# Altium project DA1_prj.PrjPcb (part 2 of 2)

## Sheet DAC.SchDoc: DAC
size 420 x 297 mm; Date: March 14; CheckedBy: ThS. Bùi Quốc Bảo; DrawnBy: Nguyễn Gia Huy; Revision: V1.0; SheetNumber: 10; SheetTotal: 11; MasterProject: STM32-PLC; Sub-system: DA1_prj.PrjPcb
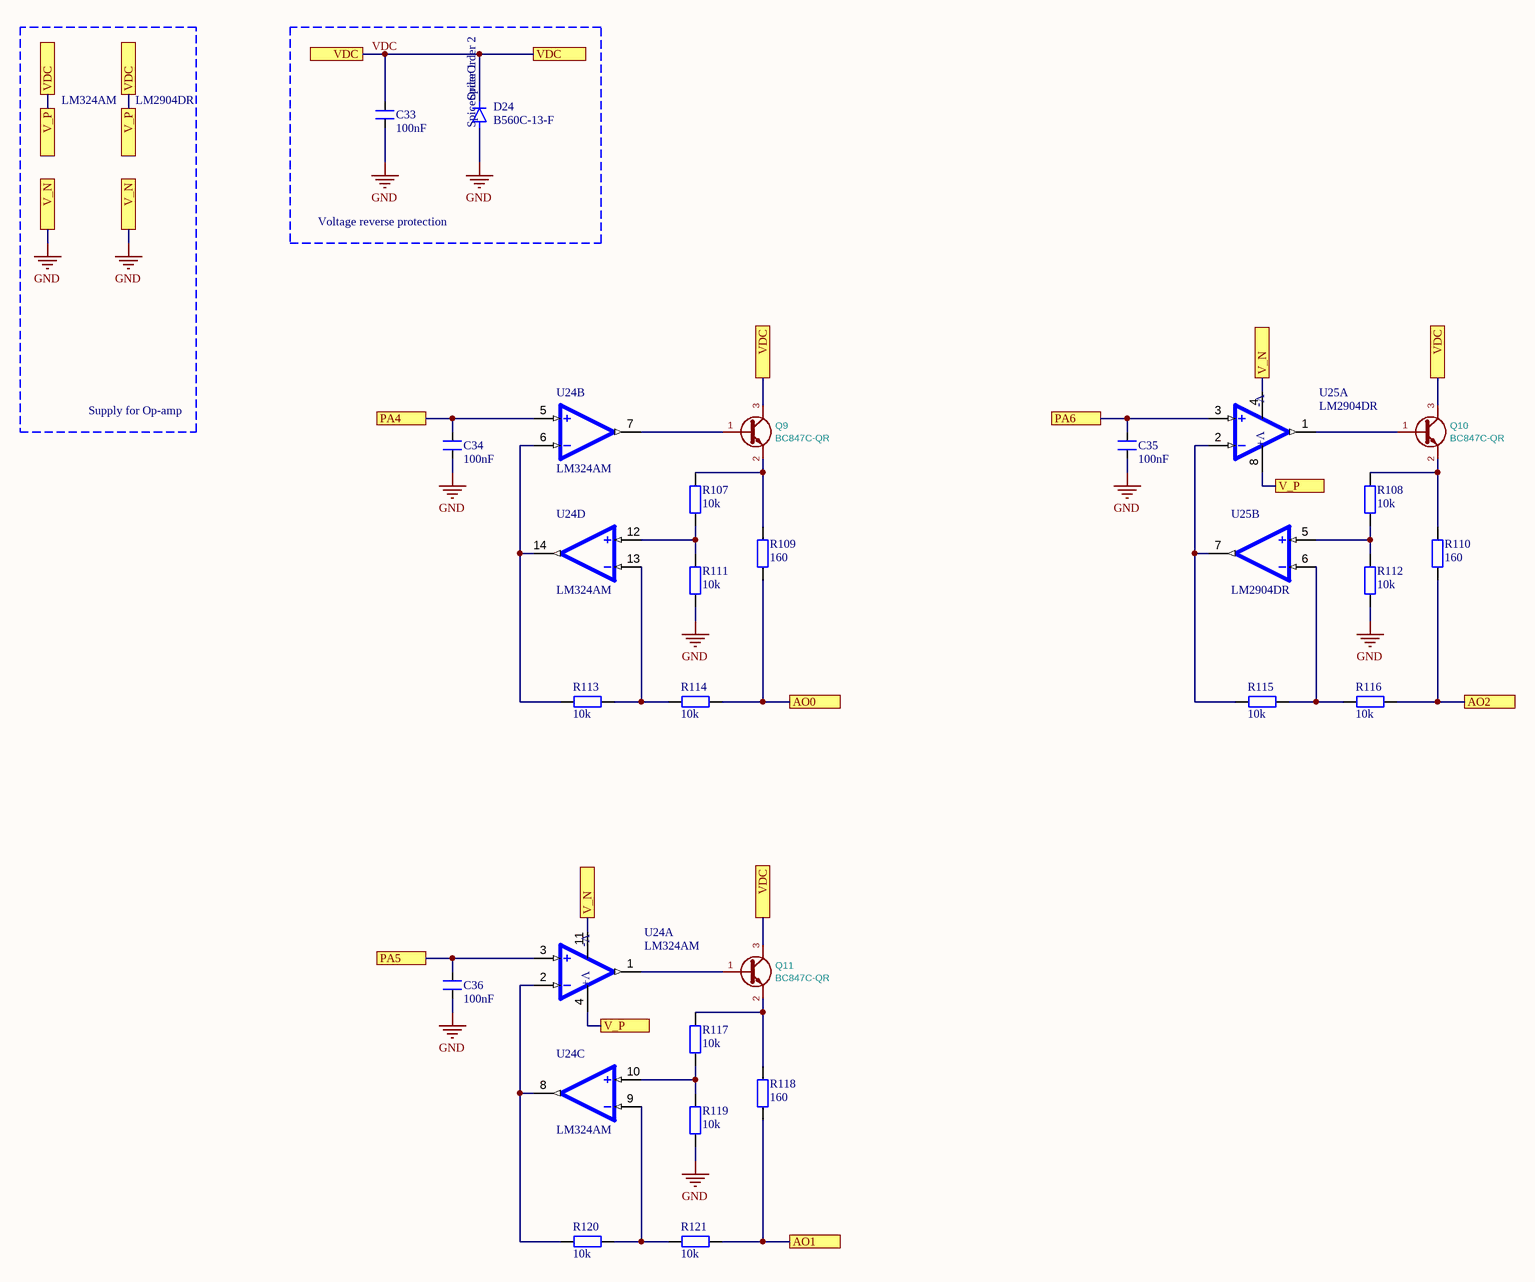
[diagram p9: DAC.SchDoc]

### Parts
C33  100nF  [FP-C0603C-CF-IPC_A]
C34  100nF  [FP-C0603C-CF-IPC_A]
C35  100nF  [FP-C0603C-CF-IPC_A]
C36  100nF  [FP-C0603C-CF-IPC_A]
D24  B560C-13-F  [SMC]
Q9  BC847C-QR  [SOT95P240X111-3N]
Q10  BC847C-QR  [SOT95P240X111-3N]
Q11  BC847C-QR  [SOT95P240X111-3N]
R107  10k  [tro smd 0603]
R108  10k  [tro smd 0603]
R109  160  [tro smd 0603]
R110  160  [tro smd 0603]
R111  10k  [tro smd 0603]
R112  10k  [tro smd 0603]
R113  10k  [tro smd 0603]
R114  10k  [tro smd 0603]
R115  10k  [tro smd 0603]
R116  10k  [tro smd 0603]
R117  10k  [tro smd 0603]
R118  160  [tro smd 0603]
R119  10k  [tro smd 0603]
R120  10k  [tro smd 0603]
R121  10k  [tro smd 0603]
U24  LM324AM  [SOIC127P600X175-14N]  (parts A,B,C,D of 4)
U25  LM2904DR  [SOIC127P599X175-8N]  (parts A,B of 2)

### Blocks framed on the sheet
Voltage reverse protection: C33 D24

### Ports
AO0 (see STM32_PLC[4C]), AO1 (see STM32_PLC[4C]), AO2 (see STM32_PLC[4C]), PA4 (see STM32_PLC[1B], STM32_PLC[4C]), PA5 (see STM32_PLC[1B], STM32_PLC[4C]), PA6 (see STM32_PLC[1B], STM32_PLC[4C]), V_N (see DAC[1A], DAC[2C]), V_N (see DAC[1A], DAC[2C], DAC[4B]), V_N (see DAC[1A], DAC[4B]), V_P (see DAC[1A], DAC[2C]), V_P (see DAC[1A], DAC[2C], DAC[4B]), V_P (see DAC[1A], DAC[4B]), VDC (see DAC[1A], DAC[2A], DAC[3B], DAC[3C], DAC[5B], STM32_PLC[4C]), VDC (see DAC[1A], DAC[2A], DAC[3B], DAC[3C], STM32_PLC[4C]), VDC (see DAC[1A], DAC[2A], DAC[3B], DAC[5B], STM32_PLC[4C]), VDC (see DAC[1A], DAC[2A], DAC[3C], DAC[5B], STM32_PLC[4C])

### Nets
GND: C33.2 C34.2 C35.2 C36.2 D24.A R111.1 R112.1 R119.1 U24.11(GND) U25.4(V-) ; port V_N
VDC: C33.1 D24.C Q9.3(C) Q10.3(C) Q11.3(C) U24.4(V+) U25.8(V+) ; port VDC, port V_P
NetC34_1: C34.1 U24.5(IN2+) ; port PA4
NetC35_1: C35.1 U25.3(IN1+) ; port PA6
NetC36_1: C36.1 U24.3(IN1+) ; port PA5
NetP4_1: R109.1 R114.1 ; port AO0
NetP4_2: R118.1 R121.1 ; port AO1
NetP4_3: R110.1 R116.1 ; port AO2
NetQ9_1: Q9.1(B) U24.7(OUT2)
NetQ9_2: Q9.2(E) R107.2 R109.2
NetQ10_1: Q10.1(B) U25.1(OUT1)
NetQ10_2: Q10.2(E) R108.2 R110.2
NetQ11_1: Q11.1(B) U24.1(OUT1)
NetQ11_2: Q11.2(E) R117.2 R118.2
NetR107_1: R107.1 R111.2 U24.12(IN4+)
NetR108_1: R108.1 R112.2 U25.5(IN2+)
NetR113_1: R113.1 R114.2 U24.13(IN4-)
NetR113_2: R113.2 U24.6(IN2-) U24.14(OUT4)
NetR115_1: R115.1 R116.2 U25.6(IN2-)
NetR115_2: R115.2 U25.2(IN1-) U25.7(OUT2)
NetR117_1: R117.1 R119.2 U24.10(IN3+)
NetR120_1: R120.1 R121.2 U24.9(IN3-)
NetR120_2: R120.2 U24.2(IN1-) U24.8(OUT3)

### Notes on the sheet
- LM324AM
- LM2904DR
- Supply for Op-amp
- Sub-system:
- Project:
- Design by:
- Sheet title:
- Sheet
- of
- Checked by:
- Approved by:
- Doc No:
- Revision:
- Size:
- Dates:
- A3
- (in symbol B560C-13-F) SpiceOrder 2; SpiceOrder 1
- (in symbol LM324AM/NOPB, part A) V-

### Library data of the parts
C33-C36 = CN-SEMI-DIP: Capacitor (Semiconductor SIM Model); Value: 104; LatestRevisionDate: 17-Jul-2002; LatestRevisionNote: Re-released for DXP Platform.; PackageReference: C1206; Publisher: Altium Limited
D24 = B560C-13-F: Diode Schottky 60 V 5A Surface Mount SMC; MF: Diodes Inc.; SnapEDA_Link: https://www.snapeda.com/parts/B560C-13-F/Diodes+Inc./view-part/?ref=snap; Package: SMC-2 Diodes; Value: *; MP: B560C-13-F; Check_prices: https://www.snapeda.com/parts/B560C-13-F/Diodes+Inc./view-part/?ref=eda
Q9-Q11 = BC847: LCSC: C2145; Value: BC847C-QR; Footprint: Package_TO_SOT_SMD:SOT-23
R107-R121 = Tro 0603 1% 10k: RES; Chung_Loai: Dán; Don_Vi: Con; So_Chan: 2; Ten_Linh_Kien: Trở 0603 1% 10k; Ma_Hang: MH006333; Kieu_Chan: *
U24 = LM324AM/NOPB: Low power general-purpose quad operational amplifier 14-SOIC 0 to 70; MF: Texas Instruments; SnapEDA_Link: https://www.snapeda.com/parts/LM324AM/Texas+Instruments/view-part/?ref=snap; Package: SOIC-14 Texas Instruments; Value: *; MP: LM324AM; Check_prices: https://www.snapeda.com/parts/LM324AM/Texas+Instruments/view-part/?ref=eda
U25 = LM2904DR: Dual, 26-V, 700-kHz operational amplifier; MF: Texas Instruments; SnapEDA_Link: https://www.snapeda.com/parts/LM2904DR/Texas+Instruments/view-part/?ref=snap; Package: SOIC-8 Texas Instruments; Value: *; MP: LM2904DR; Check_prices: https://www.snapeda.com/parts/LM2904DR/Texas+Instruments/view-part/?ref=eda

## Sheet LED.SchDoc: LED
size 420 x 297 mm; Date: March 14; CheckedBy: ThS. Bùi Quốc Bảo; DrawnBy: Nguyễn Gia Huy; Revision: V1.0; SheetNumber: 11; SheetTotal: 11; MasterProject: STM32-PLC; Sub-system: DA1_prj.PrjPcb
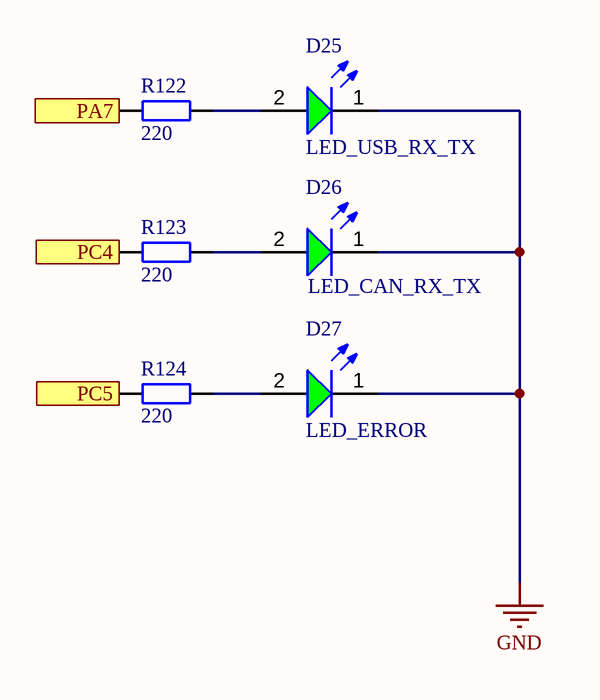
[diagram p10: LED.SchDoc]

### Parts
D25  LED_USB_RX_TX  [WL-SMCW_0603_150060xx75000]
D26  LED_CAN_RX_TX  [WL-SMCW_0603_150060xx75000]
D27  LED_ERROR  [WL-SMCW_0603_150060xx75000]
R122  220  [tro smd 0603]
R123  220  [tro smd 0603]
R124  220  [tro smd 0603]

### Ports
PA7 (see STM32_PLC[1B], STM32_PLC[5C]), PC4 (see STM32_PLC[2B], STM32_PLC[5C]), PC5 (see STM32_PLC[2B], STM32_PLC[5C])

### Nets
GND: D25.1(K) D26.1(K) D27.1(K)
NetD25_2: D25.2(A) R122.2
NetD26_2: D26.2(A) R123.2
NetD27_2: D27.2(A) R124.2
NetR122_1: R122.1 ; port PA7
NetR123_1: R123.1 ; port PC4
NetR124_1: R124.1 ; port PC5

### Notes on the sheet
- Sub-system:
- Project:
- Design by:
- Sheet title:
- Sheet
- of
- Checked by:
- Approved by:
- Doc No:
- Revision:
- Size:
- Dates:
- A3

### Library data of the parts
D25-D27 = CMP-1426-00002-4: 430mcd Colorless transparence 520nm Emerald 140° LED0603 Light Emitting Diodes (LED) ROHS; Peak Wavelength: 515nm; Forward Current: 100mA; Reverse Voltage: 5V; Output Current: 10µA; Power Dissipation: 105mW; Lens Style: Clear, Rectangular; Dominant Wavelength: 525nm; Color: Green; Test Current: 20mA; Max Junction Temperature (Tj): 95°C; Forward Voltage: 3.2V; Width: 800µm; Max Operating Temperature: 85°C; Case Code (Metric): 1608; Luminous Intensity: 430mcd; Lead Free: Lead Free; Case/Package: 0603; Case Code (Imperial): 0603; Mount: Surface Mount; Max Reverse Voltage (DC): 5V; Packaging: Tape and Reel; RoHS: Compliant; Viewing Angle: 140°; REACH SVHC: Unknown; Min Operating Temperature: -40°C; Height: 700µm; Wavelength: 525nm; Length: 1.6mm
R122-R124 = Tro 0603 1% 10k: as R107 on sheet DAC; Kieu_Chan: *

## Nets that join several sheets
+3,3V: STM32_PLC (32 pins), INPUT (10 pins), PULSE (10 pins), CAN (C30.2 U3.3)
+5V: STM32_PLC (C11.2 U1.1 U1.3 X1.1), INPUT (10 pins), PULSE (10 pins)
GND: STM32_PLC (44 pins), INPUT (30 pins), DIGTITAL (32 pins), DSDADC (20 pins), PULSE (20 pins), CAN (8 pins), SDADC (24 pins), DAC (10 pins), LED (D25.1 D26.1 D27.1)
NetC27_2: STM32_PLC (P1.6), CAN (C27.2 D1.1 R3.2 U3.7)
NetC29_1: STM32_PLC (U2.81), CAN (C29.1 U3.4)
NetC31_2: STM32_PLC (U2.82), CAN (C31.2 U3.1)
NetC32_2: STM32_PLC (P1.5), CAN (C32.2 D1.2 R6.1 U3.6)
NetC34_1: STM32_PLC (U2.29), DAC (C34.1 U24.5)
NetC35_1: STM32_PLC (U2.31), DAC (C35.1 U25.3)
NetC36_1: STM32_PLC (U2.30), DAC (C36.1 U24.3)
NetD2_3: STM32_PLC (U2.62), DSDADC (D2.3 R43.2)
NetD3_3: STM32_PLC (U2.58), DSDADC (D3.3 R44.2)
NetD4_3: STM32_PLC (U2.53), DSDADC (D4.3 R45.2)
NetD5_3: STM32_PLC (U2.61), DSDADC (D5.3 R49.2)
NetD6_3: STM32_PLC (U2.57), DSDADC (D6.3 R50.2)
NetD7_3: STM32_PLC (U2.54), DSDADC (D7.3 R51.2)
NetD8_3: STM32_PLC (U2.60), DSDADC (D8.3 R55.2)
NetD9_3: STM32_PLC (U2.56), DSDADC (D9.3 R56.2)
NetD10_3: STM32_PLC (U2.59), DSDADC (D10.3 R59.2)
NetD11_3: STM32_PLC (U2.55), DSDADC (D11.3 R60.2)
NetD12_3: STM32_PLC (U2.46), SDADC (D12.3 R83.2)
NetD13_3: STM32_PLC (U2.42), SDADC (D13.3 R84.2)
NetD14_3: STM32_PLC (U2.38), SDADC (D14.3 R85.2)
NetD15_3: STM32_PLC (U2.45), SDADC (D15.3 R89.2)
NetD16_3: STM32_PLC (U2.41), SDADC (D16.3 R90.2)
NetD17_3: STM32_PLC (U2.37), SDADC (D17.3 R91.2)
NetD18_3: STM32_PLC (U2.44), SDADC (D18.3 R95.2)
NetD19_3: STM32_PLC (U2.40), SDADC (D19.3 R96.2)
NetD20_3: STM32_PLC (U2.36), SDADC (D20.3 R97.2)
NetD21_3: STM32_PLC (U2.43), SDADC (D21.3 R101.2)
NetD22_3: STM32_PLC (U2.39), SDADC (D22.3 R102.2)
NetD23_3: STM32_PLC (U2.35), SDADC (D23.3 R103.2)
NetF1_1: STM32_PLC (P6.1), DIGTITAL (F1.1)
NetF2_1: STM32_PLC (P9.1), DIGTITAL (F2.1)
NetF3_1: STM32_PLC (P6.6), DIGTITAL (F3.1)
NetF4_1: STM32_PLC (P6.4), DIGTITAL (F4.1)
NetF5_1: STM32_PLC (P6.2), DIGTITAL (F5.1)
NetF6_1: STM32_PLC (P9.2), DIGTITAL (F6.1)
NetF7_1: STM32_PLC (P6.5), DIGTITAL (F7.1)
NetF8_1: STM32_PLC (P6.3), DIGTITAL (F8.1)
NetF9_2: STM32_PLC (P5.4), DSDADC (F9.2)
NetF10_2: STM32_PLC (P8.6), DSDADC (F10.2)
NetF11_2: STM32_PLC (P8.1), DSDADC (F11.2)
NetF12_2: STM32_PLC (P5.3), DSDADC (F12.2)
NetF13_2: STM32_PLC (P8.5), DSDADC (F13.2)
NetF14_2: STM32_PLC (P8.2), DSDADC (F14.2)
NetF15_2: STM32_PLC (P5.2), DSDADC (F15.2)
NetF16_2: STM32_PLC (P8.4), DSDADC (F16.2)
NetF17_2: STM32_PLC (P5.1), DSDADC (F17.2)
NetF18_2: STM32_PLC (P8.3), DSDADC (F18.2)
NetF19_2: STM32_PLC (P2.6), SDADC (F19.2)
NetF20_2: STM32_PLC (P2.2), SDADC (F20.2)
NetF21_2: STM32_PLC (P3.4), SDADC (F21.2)
NetF22_2: STM32_PLC (P2.5), SDADC (F22.2)
NetF23_2: STM32_PLC (P2.1), SDADC (F23.2)
NetF24_2: STM32_PLC (P3.3), SDADC (F24.2)
NetF25_2: STM32_PLC (P2.4), SDADC (F25.2)
NetF26_2: STM32_PLC (P3.6), SDADC (F26.2)
NetF27_2: STM32_PLC (P3.2), SDADC (F27.2)
NetF28_2: STM32_PLC (P2.3), SDADC (F28.2)
NetF29_2: STM32_PLC (P3.5), SDADC (F29.2)
NetF30_2: STM32_PLC (P3.1), SDADC (F30.2)
NetP1_1: STM32_PLC (P1.1), PULSE (R79.1 U22.1)
NetP1_2: STM32_PLC (P1.2), PULSE (R75.1 U20.1)
NetP1_3: STM32_PLC (P1.3), PULSE (R69.1 U17.1)
NetP1_4: STM32_PLC (P1.4), PULSE (R63.1 U14.1)
NetP4_1: STM32_PLC (P4.1), DAC (R109.1 R114.1)
NetP4_2: STM32_PLC (P4.2), DAC (R118.1 R121.1)
NetP4_3: STM32_PLC (P4.3), DAC (R110.1 R116.1)
NetP7_1: STM32_PLC (P7.1), PULSE (R73.1 U19.1)
NetP7_2: STM32_PLC (P7.2), PULSE (R67.1 U16.1)
NetP7_3: STM32_PLC (P7.3), PULSE (R81.1 U23.1)
NetP7_4: STM32_PLC (P7.4), PULSE (R77.1 U21.1)
NetP7_5: STM32_PLC (P7.5), PULSE (R71.1 U18.1)
NetP7_6: STM32_PLC (P7.6), PULSE (R65.1 U15.1)
NetP10_1: STM32_PLC (P10.1), INPUT (R25.1 SW2.11 U13.1)
NetP10_2: STM32_PLC (P10.2), INPUT (R21.1 SW2.12 U11.1)
NetP10_3: STM32_PLC (P10.3), INPUT (R17.1 SW2.13 U9.1)
NetP10_4: STM32_PLC (P10.4), INPUT (R13.1 SW2.14 U7.1)
NetP11_1: STM32_PLC (P11.1), INPUT (R9.1 SW2.15 U5.1)
NetP11_2: STM32_PLC (P11.2), INPUT (R23.1 SW2.16 U12.1)
NetP11_3: STM32_PLC (P11.3), INPUT (R19.1 SW2.17 U10.1)
NetP11_4: STM32_PLC (P11.4), INPUT (R15.1 SW2.18 U8.1)
NetP11_5: STM32_PLC (P11.5), INPUT (R11.1 SW2.19 U6.1)
NetP11_6: STM32_PLC (P11.6), INPUT (R7.1 SW2.20 U4.1)
NetR8_1: STM32_PLC (U2.11), INPUT (R8.1 U4.4)
NetR10_1: STM32_PLC (U2.5), INPUT (R10.1 U5.4)
NetR12_1: STM32_PLC (U2.10), INPUT (R12.1 U6.4)
NetR14_1: STM32_PLC (U2.4), INPUT (R14.1 U7.4)
NetR16_1: STM32_PLC (U2.90), INPUT (R16.1 U8.4)
NetR18_1: STM32_PLC (U2.3), INPUT (R18.1 U9.4)
NetR20_1: STM32_PLC (U2.91), INPUT (R20.1 U10.4)
NetR22_1: STM32_PLC (U2.2), INPUT (R22.1 U11.4)
NetR24_1: STM32_PLC (U2.7), INPUT (R24.1 U12.4)
NetR26_1: STM32_PLC (U2.1), INPUT (R26.1 U13.4)
NetR27_1: STM32_PLC (U2.15), DIGTITAL (R27.1 R30.2)
NetR28_1: STM32_PLC (U2.68), DIGTITAL (R28.1 R31.2)
NetR29_1: STM32_PLC (U2.24), DIGTITAL (R29.1 R32.2)
NetR33_1: STM32_PLC (U2.18), DIGTITAL (R33.1 R36.2)
NetR34_1: STM32_PLC (U2.16), DIGTITAL (R34.1 R37.2)
NetR35_1: STM32_PLC (U2.69), DIGTITAL (R35.1 R38.2)
NetR39_1: STM32_PLC (U2.23), DIGTITAL (R39.1 R41.2)
NetR40_1: STM32_PLC (U2.17), DIGTITAL (R40.1 R42.2)
NetR122_1: STM32_PLC (U2.32), LED (R122.1)
NetR123_1: STM32_PLC (U2.33), LED (R123.1)
NetR124_1: STM32_PLC (U2.34), LED (R124.1)
NetU2_25: STM32_PLC (U2.25), PULSE (U26.6)
NetU2_26: STM32_PLC (U2.26), PULSE (U26.8)
NetU2_63: STM32_PLC (U2.63), PULSE (U27.6)
NetU2_64: STM32_PLC (U2.64), PULSE (U27.4)
NetU2_78: STM32_PLC (U2.78), PULSE (U27.2)
NetU2_79: STM32_PLC (U2.79), PULSE (U26.7)
NetU2_92: STM32_PLC (U2.92), PULSE (U26.12)
NetU2_93: STM32_PLC (U2.93), PULSE (U26.10)
NetU2_95: STM32_PLC (U2.95), PULSE (U26.4)
NetU2_96: STM32_PLC (U2.96), PULSE (U26.2)
VDC: STM32_PLC (P12.2), DAC (7 pins)